# Altium schematic sheet audiolab.SchDoc: audiolab
size A3; Author: Martín Ramírez Espinosa; Revision: 1.0; SheetNumber: 1; SheetTotal: 3
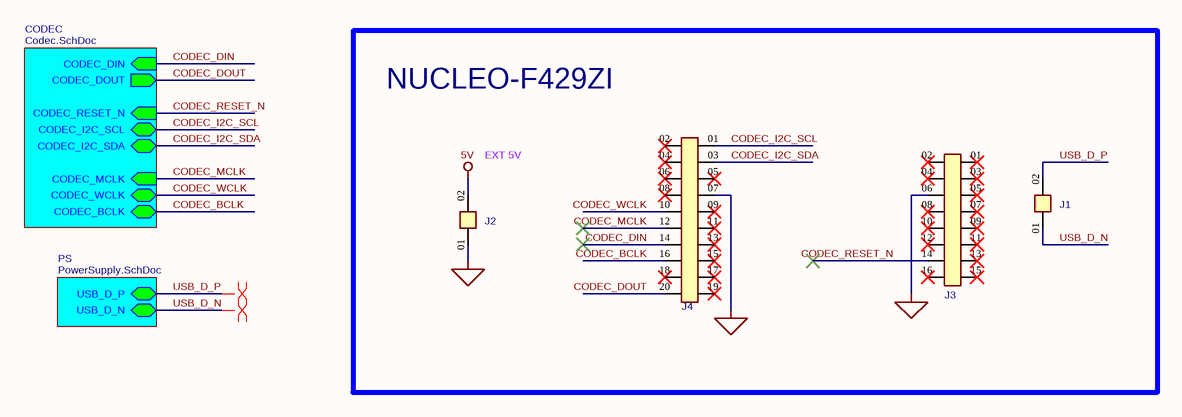
[diagram p0: audiolab.SchDoc]

## Parts
J1  HTSW-102-07-G-S  [SAMTEC_HTSW-102-XX-X-S]  (value not drawn)
J2  HTSW-102-07-G-S  [SAMTEC_HTSW-102-XX-X-S]  (value not drawn)
J3  TSW-108-07-G-D  [SAMTEC_TSW-108-07-G-D]  (value not drawn)
J4  TSW-110-07-G-D  [SAMTEC_TSW-110-07-G-D]  (value not drawn)

## Sub-sheets
CODEC = Codec.SchDoc: CODEC_BCLK (bidir), CODEC_WCLK (bidir), CODEC_MCLK (in), CODEC_I2C_SDA (bidir), CODEC_I2C_SCL (bidir), CODEC_RESET_N (in), CODEC_DIN (in), CODEC_DOUT (out)
PS = PowerSupply.SchDoc: USB_D_P (bidir), USB_D_N (bidir)

## Nets
5V: J2.02
GND: J2.01 J3.06 J4.07
CODEC_BCLK: J4.16 ; sheet CODEC/CODEC_BCLK
CODEC_DIN: J4.14 ; sheet CODEC/CODEC_DIN
CODEC_DOUT: J4.20 ; sheet CODEC/CODEC_DOUT
CODEC_I2C_SCL: J4.01 ; sheet CODEC/CODEC_I2C_SCL
CODEC_I2C_SDA: J4.03 ; sheet CODEC/CODEC_I2C_SDA
CODEC_MCLK: J4.12 ; sheet CODEC/CODEC_MCLK
CODEC_RESET_N: J3.14 ; sheet CODEC/CODEC_RESET_N
CODEC_WCLK: J4.10 ; sheet CODEC/CODEC_WCLK
USB_D_N: J1.01 ; sheet PS/USB_D_N
USB_D_P: J1.02 ; sheet PS/USB_D_P

Not connected (* = marked no-connect by the designer): J3 01* 02* 03* 04* 05* 07* 08* 09* 10* 11* 12* 13* 15* 16*; J4 02* 04* 05* 06* 08* 09* 11* 13* 15* 17* 18* 19*

## Layout directives
differential pair: USB_D_N, USB_D_P

## Notes on the sheet
- NUCLEO-F429ZI
- (near J2) EXT 5V

## Library data of the parts
J1 J2 = HTSW-102-07-G-S: Pin Header, Vertical, Board-to-Board, 2.54 mm, 1 Rows, 2 Contacts, Through Hole, HTSW; Manufacturer: Samtec Inc.; Value: *; Manufacturer Part Number: HTSW-102-07-G-S; Supplier Part Number: SAM8736-ND; Supplier: DigiKey; Package/Case: Bag
J3 = TSW-108-07-G-D: Pin Header, Unshrouded, Board-to-Board, 2.54 mm, 2 Rows, 16 Contacts, Through Hole, TSW; Manufacturer: Samtec Inc.; Value: *; Manufacturer Part Number: TSW-108-07-G-D; Supplier Part Number: SAM1028-08-ND; Supplier: DigiKey; Package/Case: Bulk
J4 = TSW-110-07-G-D: Pin Header, Vertical, Board-to-Board, 2.54 mm, 2 Rows, 20 Contacts, Through Hole, HTSW Series; Manufacturer: Samtec Inc.; Supplier: DigiKey; Supplier Part Number: SAM1028-10-ND; Manufacturer Part Number: TSW-110-07-G-D; Value: *; Package/Case: Bulk